# EasyEDA Pro project Driver.epro

# Schematic Schematic1
Create Date: 2023-10-04; Page Name: P1; Project Name: BLDC_V0.1; Schematic Name: Schematic1; Update Date: 2023-10-04; Company: 嘉立创EDA; Page Size: A4; Version: V1.0
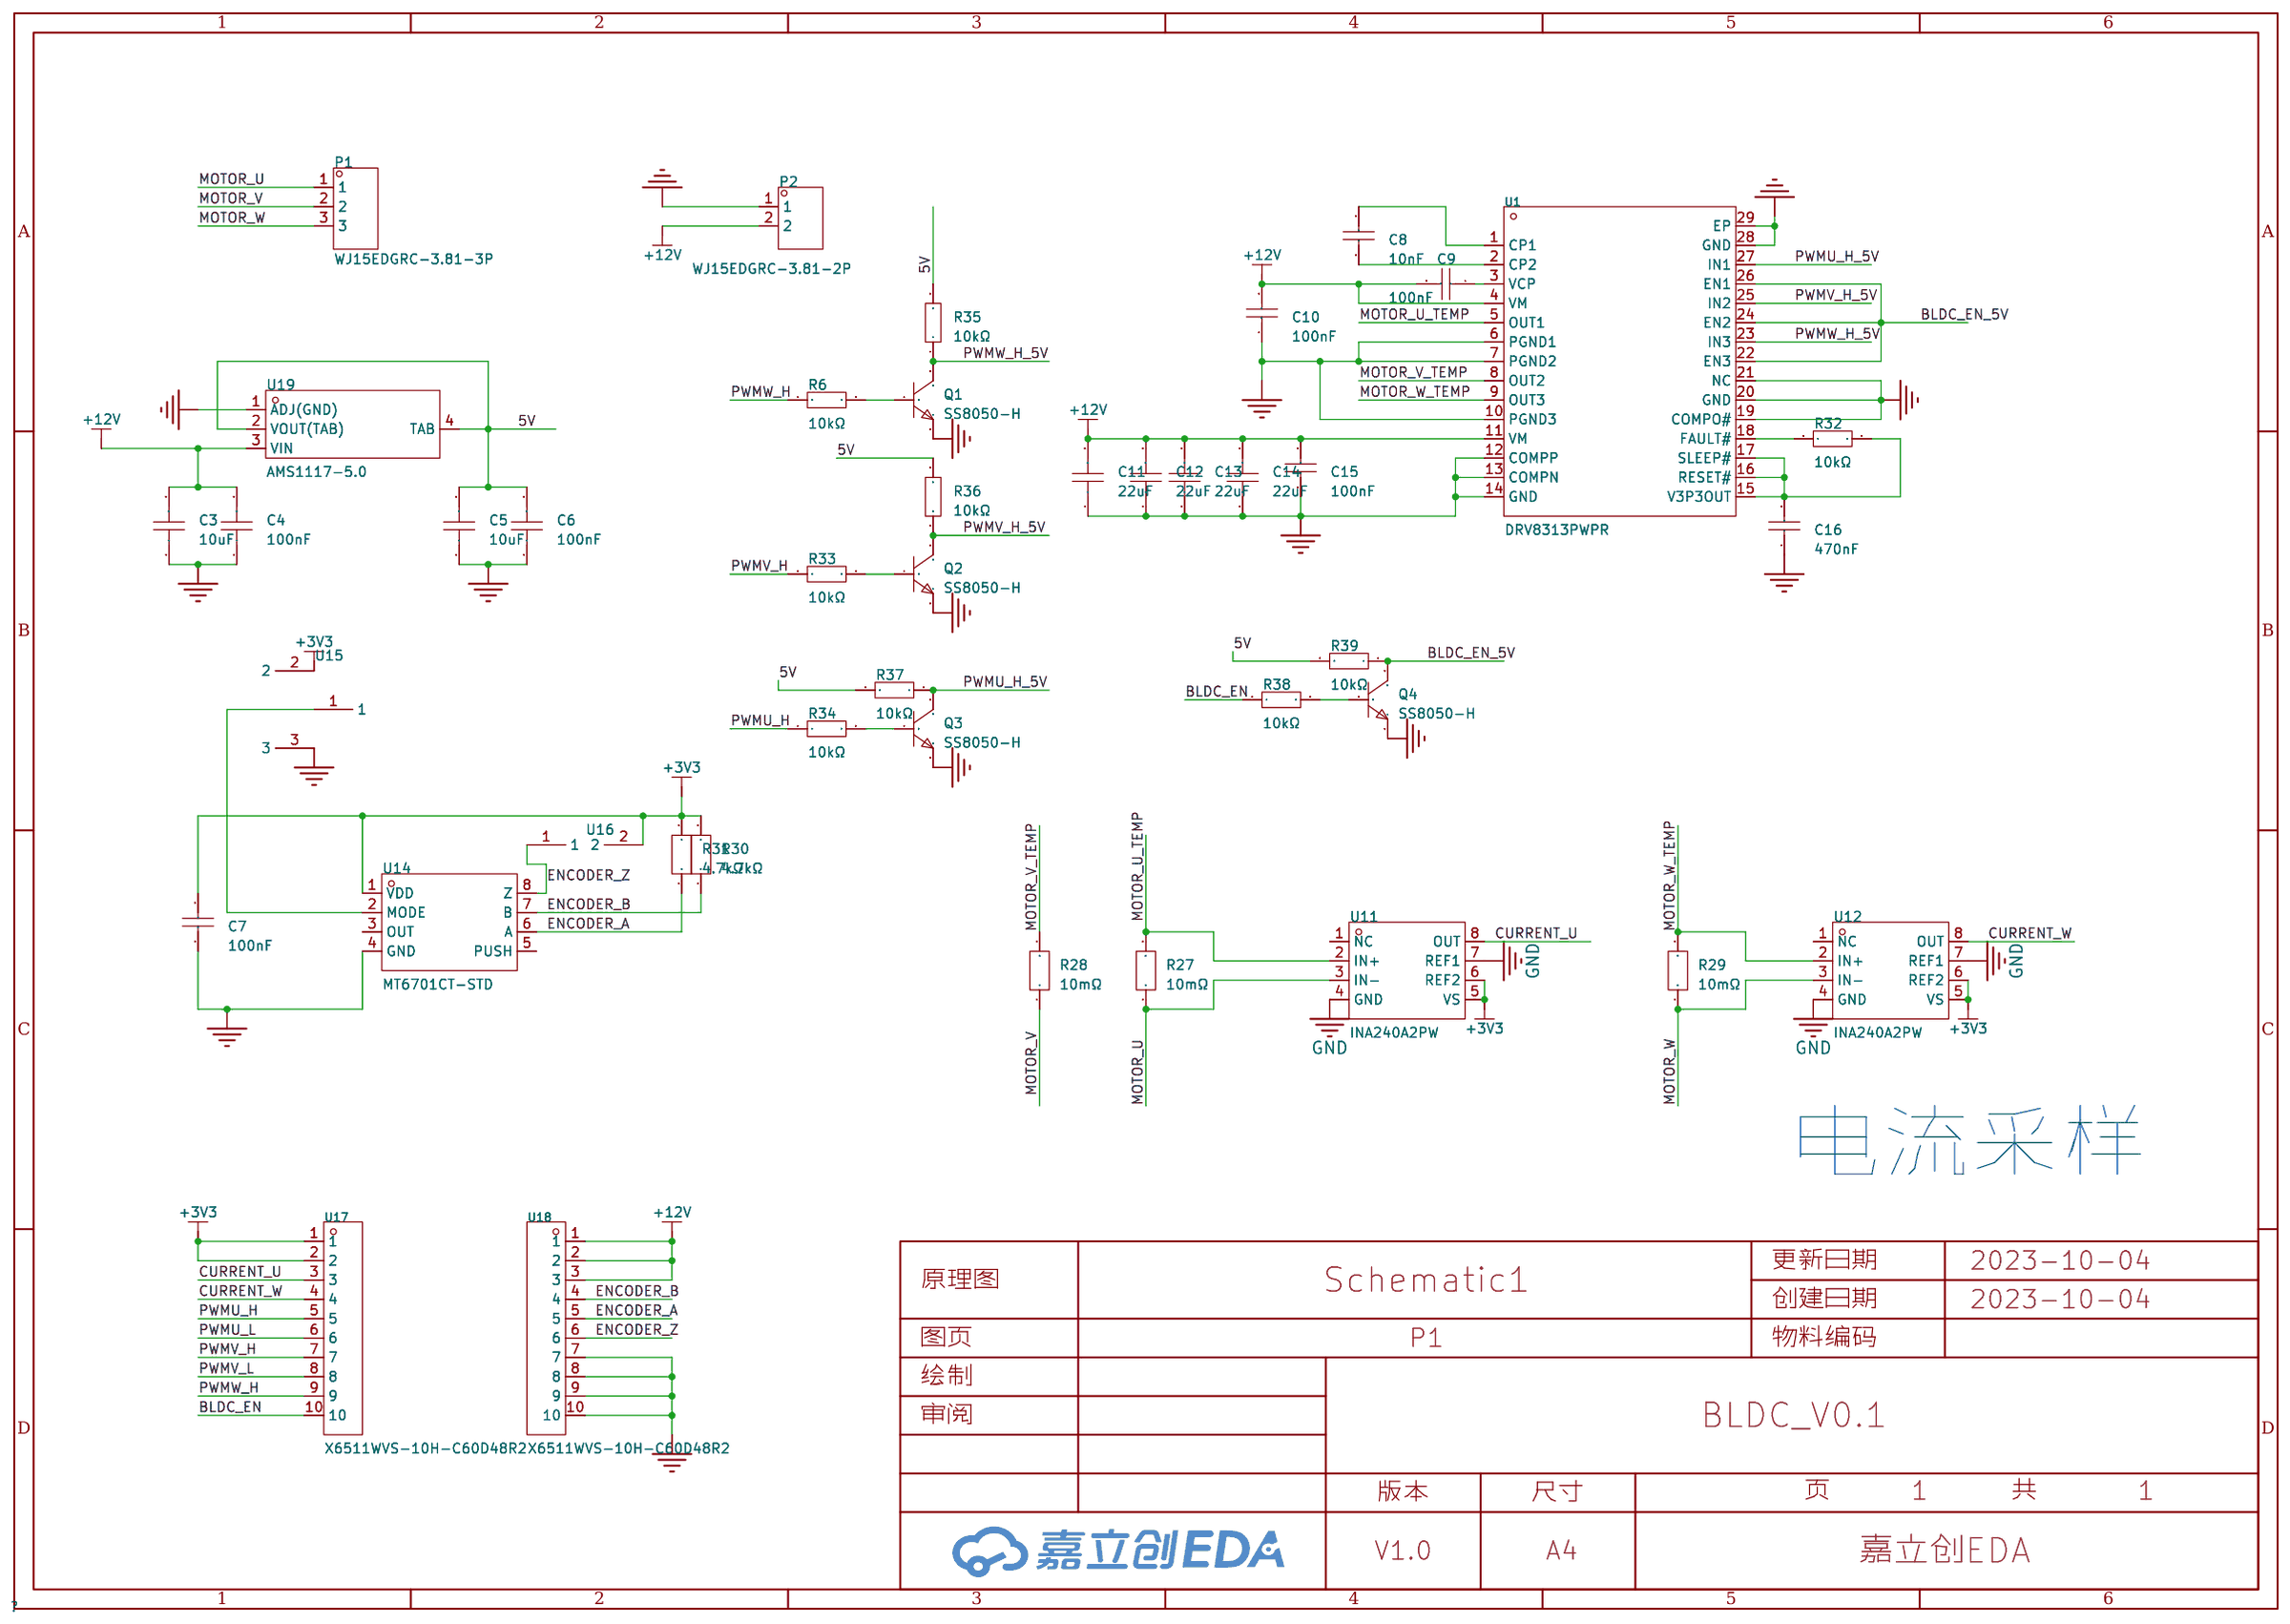
[diagram p0: schematic sheet]

## Parts
C3  10uF  [C0603]
C4  100nF  [C0603]
C5  10uF  [C0603]
C6  100nF  [C0603]
C7  100nF  [C0603]
C8  10nF  [C0603]
C9  100nF  [C0603]
C10  100nF  [C0603]
C11  22uF  [C0805]
C12  22uF  [C0805]
C13  22uF  [C0805]
C14  22uF  [C0805]
C15  100nF  [C0603]
C16  470nF  [C0603]
P1  WJ15EDGRC-3.81-3P  [CONN-TH_3P-P3.81_WJ15EDGRC-3.81-3P]
P2  WJ15EDGRC-3.81-2P  [CONN-TH_2P-P3.81_WJ15EDGRC-3.81-2P]
Q1  SS8050-H  [SOT-23-3_L2.9-W1.3-P1.90-LS2.4-BR]
Q2  SS8050-H  [SOT-23-3_L2.9-W1.3-P1.90-LS2.4-BR]
Q3  SS8050-H  [SOT-23-3_L2.9-W1.3-P1.90-LS2.4-BR]
Q4  SS8050-H  [SOT-23-3_L2.9-W1.3-P1.90-LS2.4-BR]
R6  10kΩ  [R0603]
R27  10mΩ  [RES-SMD_L6.4-W3.2-R2512]
R28  10mΩ  [RES-SMD_L6.4-W3.2-R2512]
R29  10mΩ  [RES-SMD_L6.4-W3.2-R2512]
R30  4.7kΩ  [R0603]
R31  4.7kΩ  [R0603]
R32  10kΩ  [R0603]
R33  10kΩ  [R0603]
R34  10kΩ  [R0603]
R35  10kΩ  [R0603]
R36  10kΩ  [R0603]
R37  10kΩ  [R0603]
R38  10kΩ  [R0603]
R39  10kΩ  [R0603]
U1  DRV8313PWPR  [HTSSOP-28_L9.8-W4.5-P0.65-LS6.6-BL-EP]
U11  INA240A2PW  [TSSOP-8_L4.4-W3.0-P0.65-LS6.4-BR]
U12  INA240A2PW  [TSSOP-8_L4.4-W3.0-P0.65-LS6.4-BR]
U14  MT6701CT-STD  [SOP-8_L4.9-W3.9-P1.27-LS6.0-BL]
U15  -  [三端短接调试]
U16  -  [两端短接调试位]
U17  X6511WVS-10H-C60D48R2  [HDR-SMD_10P-P2.54-V-M-LS4.8_R2]
U18  X6511WVS-10H-C60D48R2  [HDR-SMD_10P-P2.54-V-M-LS4.8_R2]
U19  AMS1117-5.0  [SOT-223_L6.7-W3.5-P2.30-BR]

## Library data of the parts
C3 C5 = CL10A106MA8NRNC: 容值:10uF;精度:±20%;额定电压:25V;材质(温度系数):X5R;; LCSC Part Name: 10uF±20%25V; Supplier Part: C96446; Manufacturer: SAMSUNG(三星); Supplier Footprint: 0603; JLCPCB Part Class: BasicPart; Datasheet: https://atta.szlcsc.com/upload/public/pdf/source/20170325/1490427913016.pdf; Supplier: LCSC; Tolerance: ±20%; Voltage Rated: 25V; Temperature Coefficient: X5R
C4 C6 = CC0603KRX7R9BB104: 容值:100nF;精度:±10%;额定电压:50V;材质(温度系数):X7R;; LCSC Part Name: 100nF±10%50V; Supplier Part: C30926; Manufacturer: YAGEO(国巨); Supplier Footprint: 0603; JLCPCB Part Class: BasicPart; Datasheet: https://atta.szlcsc.com/upload/public/pdf/source/20180910/C282072_33301C7F631E79921B82A8DAC6BCC5B3.pdf; Supplier: LCSC; Tolerance: ±10%; Voltage Rated: 50V; Temperature Coefficient: X7R
C7 C9 C10 C15 = 0603B104K500NT: 容值:100nF;精度:±10%;额定电压:50V;材质(温度系数):X7R;; LCSC Part Name: 100nF±10%50V; Supplier Part: C30926; Manufacturer: FH(风华); Supplier Footprint: 0603; JLCPCB Part Class: ExtendedPart; Datasheet: https://atta.szlcsc.com/upload/public/pdf/source/20170923/C30926_1506149436298988724.pdf; Supplier: LCSC; Tolerance: ±10%; Voltage Rated: 50V; Temperature Coefficient: X7R
C8 = CC0603KRX7R9BB103: 容值:10nF;精度:±10%;额定电压:50V;材质(温度系数):X7R;; LCSC Part Name: 10nF ±10% 50V; Supplier Part: C100042; Manufacturer: YAGEO(国巨); Supplier Footprint: 0603; JLCPCB Part Class: Extended Part; Datasheet: https://atta.szlcsc.com/upload/public/pdf/source/20180326/C100042_E8B0111D51DE3671A0A4A59FBCEFE81C.pdf; Supplier: LCSC; Tolerance: ±10%; Voltage Rated: 50V; Temperature Coefficient: X7R
C11-C14 = CL21A226MAQNNNE_C45783: 容值:22uF;精度:±20%;额定电压:25V;材质(温度系数):X5R;; LCSC Part Name: 22uF ±20% 25V; Supplier Part: C45783; Manufacturer: SAMSUNG(三星); Manufacturer Part: CL21A226MAQNNNE; Supplier Footprint: 0805; JLCPCB Part Class: 基础库; Datasheet: https://atta.szlcsc.com/upload/public/pdf/source/20160103/1457707727161.pdf; Supplier: LCSC; Tolerance: ±20%; Voltage Rated: 25V; Temperature Coefficient: X5R
C16 = CL10B474KA8NNNC: 容值:470nF;精度:±10%;额定电压:25V;材质(温度系数):X7R;; LCSC Part Name: 470nF ±10% 25V; Supplier Part: C1623; Manufacturer: SAMSUNG(三星); Supplier Footprint: 0603; JLCPCB Part Class: Basic Part; Datasheet: https://atta.szlcsc.com/upload/public/pdf/source/20160103/1457707685435.pdf; Supplier: LCSC; Tolerance: ±10%; Voltage Rated: 25V; Temperature Coefficient: X7R
P1 = WJ15EDGRC-3.81-3P: 连接器类型:板端/插座-闭口;结构:1x3P;间距:3.81mm;排数:1;每排PIN数:3;安装方式:弯针;颜色:绿色;; LCSC Part Name: 板端/插座-闭口 1x3P 3.81mm 排数:1 每排P数:3 弯针; Supplier Part: C8406; Manufacturer: KANGNEX(康奈克斯电气); Supplier Footprint: 弯插,P=3.81mm; JLCPCB Part Class: Extended Part; Datasheet: https://atta.szlcsc.com/upload/public/pdf/source/20191225/C8406_B27C5DC97AFF46E3E6AAC690B6FE6CCE.pdf; Supplier: LCSC; Connector Type: 板端/插座-闭口; Structure: 1x3P; Pitch: 3.81mm; Number of Rows: 1; Number of PINs Per Row: 3; Mounting Style: 弯针; Color: 绿色
P2 = WJ15EDGRC-3.81-2P: 连接器类型:板端/插座-闭口;间距:3.81mm;排数:1;每排PIN数:2;安装方式:弯针;颜色:绿色;; LCSC Part Name: 板端/插座-闭口 3.81mm 排数:1 每排P数:2 弯针; Supplier Part: C8387; Manufacturer: KANGNEX(康奈克斯电气); Supplier Footprint: 弯插,P=3.81mm; JLCPCB Part Class: Extended Part; Datasheet: https://atta.szlcsc.com/upload/public/pdf/source/20191225/C8387_8EBAF10345D2762F0167C8753398EEFA.pdf; Supplier: LCSC; Connector Type: 板端/插座-闭口; Pitch: 3.81mm; Number of Rows: 1; Number of PINs Per Row: 2; Mounting Style: 弯针; Color: 绿色
Q1-Q4 = SS8050-H: 晶体管类型:NPN;集射极击穿电压(Vceo):25V;集电极电流(Ic):1.5A;功率(Pd):300mW;直流电流增益(hFE@Ic,Vce):200@100mA,1V;; LCSC Part Name: NPN25V1.5A; Supplier Part: C699255; Manufacturer: YANGJIE(扬杰); Supplier Footprint: SOT-23-3L; JLCPCB Part Class: ExtendedPart; Datasheet: https://atta.szlcsc.com/upload/public/pdf/source/20200709/C699255_98BD284548BE18129453A2CE3A1F2C22.pdf; Supplier: LCSC; Transistor Type: NPN; Collector-Emitter Breakdown Voltage (Vceo): 25V; Collector Current (Ic): 1.5A; Power Dissipation (Pd): 300mW; Collector Cut-Off Current (Icbo): 100nA; Collector-Emitter Saturation Voltage (VCE(sat)@Ic,Ib): 500mV@800mA,80mA; DC Current Gain (hFE@Ic,Vce): 200@100mA,1V; Transition Frequency (fT): 100MHz; Operating Temperature: -55℃~+150℃@(Tj)
R6 R33-R39 = ERJ3EKF1002V: 电阻类型:厚膜电阻;阻值:10kΩ;精度:±1%;功率:100mW;; LCSC Part Name: 厚膜电阻10kΩ±1%100mW; Supplier Part: C25804; Manufacturer: PANASONIC(松下); Supplier Footprint: 0603; JLCPCB Part Class: ExtendedPart; Datasheet: https://atta.szlcsc.com/upload/public/pdf/source/20180502/C191124_A4CEFA964CCDF04BFD540D495CFFCAE0.pdf; Supplier: LCSC; Type: 厚膜电阻; Tolerance: ±1%; Power(Watts): 100mW; Temperature Coefficient: ±100ppm/℃; Operating Temperature Range: -55℃~+155℃
R27-R29 = HoJLR2512-3W-10mR-1%: 阻值:10mΩ;功率:3W;; LCSC Part Name: 10mΩ 3W; Supplier Part: C2903468; Manufacturer: Milliohm(毫欧); Supplier Footprint: 2512; JLCPCB Part Class: Extended Part; Datasheet: https://atta.szlcsc.com/upload/public/pdf/source/20211009/7525CABAB363C979E942C1DD41F1FEF0.pdf; Supplier: LCSC; Power(Watts): 3W
R30 R31 = HoLTT0603-1/10W-4.7K-1%: 阻值:4.7kΩ;功率:100mW;; LCSC Part Name: 4.7kΩ 100mW; Supplier Part: C2904521; Manufacturer: Milliohm(毫欧); Supplier Footprint: 0603; JLCPCB Part Class: Extended Part; Datasheet: https://atta.szlcsc.com/upload/public/pdf/source/20211021/528351F376078D6228C985A842C3763C.pdf; Supplier: LCSC; Power(Watts): 100mW
R32 = 0603WAF1002T5E: 电阻类型:厚膜电阻;阻值:10kΩ;精度:±1%;功率:100mW;; LCSC Part Name: 厚膜电阻 10kΩ ±1% 100mW; Supplier Part: C25804; Manufacturer: UNI-ROYAL(厚声); Supplier Footprint: 0603; JLCPCB Part Class: 基础库; Datasheet: https://atta.szlcsc.com/upload/public/pdf/source/20200306/C422600_1E6D84923E4A46A82E41ADD87F860B5C.pdf; Supplier: LCSC; Type: 厚膜电阻; Tolerance: ±1%; Power(Watts): 100mW; Temperature Coefficient: ±100ppm/℃; Overload Voltage (Max): 75V; Operating Temperature Range: -55℃~+155℃
U1 = DRV8313PWPR: 类型:无刷直流BLDC;电源电压:8V~60V;输出电流:-;接口:并行;; LCSC Part Name: 无刷直流BLDC电机驱动芯片 60V; Supplier Part: C92482; Manufacturer: TI(德州仪器); Supplier Footprint: TSSOP-28-EP; JLCPCB Part Class: 扩展库; Datasheet: https://www.ti.com/cn/lit/gpn/drv8313; Supplier: LCSC; Type: 无刷直流BLDC; Supply Voltage: 8V~60V; Interface: 并行; Operating Temperature: -40℃~+150℃@(Tj)
U11 U12 = INA240A2PW: 具有增强的 PWM 抑制能力的 -4V 至 80V、双向、超精密电流感应放大器 8-TSSOP -40 to 125; Supplier Part: C1346461; Manufacturer: TI(德州仪器); Supplier Footprint: TSSOP-8-3.0mm; JLCPCB Part Class: Extended Part; Datasheet: https://atta.szlcsc.com/upload/public/pdf/source/20210607/AED5CCB0280C8C5A414BD6EEEB43F6C3.pdf; Supplier: LCSC
U14 = MT6701CT-STD: 磁性编码器 磁性编码开关 磁性角度检测IC 可编程磁性角度位置芯片; LCSC Part Name: 霍尔在线编程角度位置传感器; Supplier Part: C2856764; Manufacturer: MagnTek(麦歌恩); Supplier Footprint: SOP-8; JLCPCB Part Class: 扩展库; Datasheet: https://atta.szlcsc.com/upload/public/pdf/source/20210901/89396AA55DF26524CEF7734A3D9C2FB3.pdf; Supplier: LCSC
U15 = 三段短接调试
U16 = 两端短接调试位
U17 U18 = X6511WVS-10H-C60D48R2: 间距:2.54mm;总PIN位数:10;排数:1;插针结构:1x10P;行距:-;安装类型:立贴;圆针/方针:方针;额定电流:3A;额定电压:250V;配合针长度:6mm;塑高:2.5mm;触头材质:黄铜;触头镀层:金;工作温度范围:-40℃~+105℃;焊接温度(最大值):260℃;; LCSC Part Name: 2.54mm 1x10P; Supplier Part: C2883767; Manufacturer: XKB Connectivity(中国星坤); Supplier Footprint: SMD,P=2.54mm(交错脚); JLCPCB Part Class: 扩展库; Supplier: LCSC; Pitch: 2.54mm; Number of Pins: 10; Number of Rows: 1; Pin Structure: 1x10P; Mounting Type: 立贴; Circluar Pins/Square Pins: 方针; Current Rating (Max): 3A; Voltage Rating (Max): 250V; Length of Mating Pin: 6mm; Insulation Height: 2.5mm; Contact Material: 黄铜; Contact Plating: 金; Operating Temperature Range: -40℃~+105℃; Welding Temperature (Max): 260℃
U19 = AMS1117-5.0_C347223: 输出类型:固定;输出极性:正;最大输入电压:18V;输出电压:5V;输出电流:1A;电源纹波抑制比(PSRR):60dB@(120Hz);; LCSC Part Name: 输入18V 输出5V 1A; Supplier Part: C347223; Manufacturer: UMW(广东友台半导体); Supplier Footprint: SOT-223; JLCPCB Part Class: Extended Part; Datasheet: https://atta.szlcsc.com/upload/public/pdf/source/20211011/50CC665C22E3A66C08379A4A74BDA25C.pdf; Supplier: LCSC; Output Type: 固定; Output Polarity: 正; Number of Outputs: 1; Maximum Input Voltage: 18V; Output Voltage: 5V; Dropout Voltage: 1.3V@(1A); Output Current: 1A; Power Supply Rejection Ratio (PSRR): 60dB@(120Hz)

## Nets
5V: C5.2 C6.2 R35.2 R36.2 R37.2 R39.2 U19.2(VOUT(TAB)) U19.4(TAB)
+3V3: C7.2 R30.2 R31.2 U11.5(VS) U11.6(REF2) U12.5(VS) U12.6(REF2) U14.1(VDD) U15.2 U16.2 U17.1 U17.2
+12V: C3.2 C4.2 C9.2 C10.2 C11.2 C12.2 C13.2 C14.2 C15.1 P2.2 U1.4(VM) U1.11(VM) U18.1 U18.2 U18.3 U19.3(VIN)
GND: C3.1 C4.1 C5.1 C6.1 C7.1 C10.1 C11.1 C12.1 C13.1 C14.1 C15.2 C16.1 P2.1 Q1.2(E) Q2.2(E) Q3.2(E) Q4.2(E) U1.6(PGND1) U1.7(PGND2) U1.10(PGND3) U1.12(COMPP) U1.13(COMPN) U1.14(GND) U1.19(COMPO#) U1.20(GND) U1.21(NC) U1.28(GND) U1.29(EP) U11.4(GND) U11.7(REF1) U12.4(GND) U12.7(REF1) U14.4(GND) U15.3 U18.7 U18.8 U18.9 U18.10 U19.1(ADJ(GND))
BLDC_EN: R38.1 U17.10
BLDC_EN_5V: Q4.3(C) R39.1 U1.22(EN3) U1.24(EN2) U1.26(EN1)
CURRENT_U: U11.8(OUT) U17.3
CURRENT_W: U12.8(OUT) U17.4
ENCODER_A: R31.1 U14.6(A) U18.5
ENCODER_B: R30.1 U14.7(B) U18.4
ENCODER_Z: U14.8(Z) U16.1 U18.6
MOTOR_U: P1.1 R27.1 U11.3(IN-)
MOTOR_U_TEMP: R27.2 U1.5(OUT1) U11.2(IN+)
MOTOR_V: P1.2 R28.1
MOTOR_V_TEMP: R28.2 U1.8(OUT2)
MOTOR_W: P1.3 R29.1 U12.3(IN-)
MOTOR_W_TEMP: R29.2 U1.9(OUT3) U12.2(IN+)
PWMU_H: R34.1 U17.5
PWMU_H_5V: Q3.3(C) R37.1 U1.27(IN1)
PWMU_L: U17.6
PWMV_H: R33.1 U17.7
PWMV_H_5V: Q2.3(C) R36.1 U1.25(IN2)
PWMV_L: U17.8
PWMW_H: R6.1 U17.9
PWMW_H_5V: Q1.3(C) R35.1 U1.23(IN3)
$1N503: U14.2(MODE) U15.1
$1N1583: C8.1 U1.2(CP2)
$1N1586: C8.2 U1.1(CP1)
$1N1604: C9.1 U1.3(VCP)
$1N1822: R32.2 U1.18(FAULT#)
$1N1825: C16.2 R32.1 U1.15(V3P3OUT) U1.16(RESET#) U1.17(SLEEP#)
$1N2334: Q1.1(B) R6.2
$1N2420: Q2.1(B) R33.2
$1N2505: Q3.1(B) R34.2
$1N2864: Q4.1(B) R38.2

Not connected (* = marked no-connect by the designer): U11 1(NC); U12 1(NC); U14 3(OUT) 5(PUSH)

## Notes on the sheet
- 电流采样

# Board PCB1
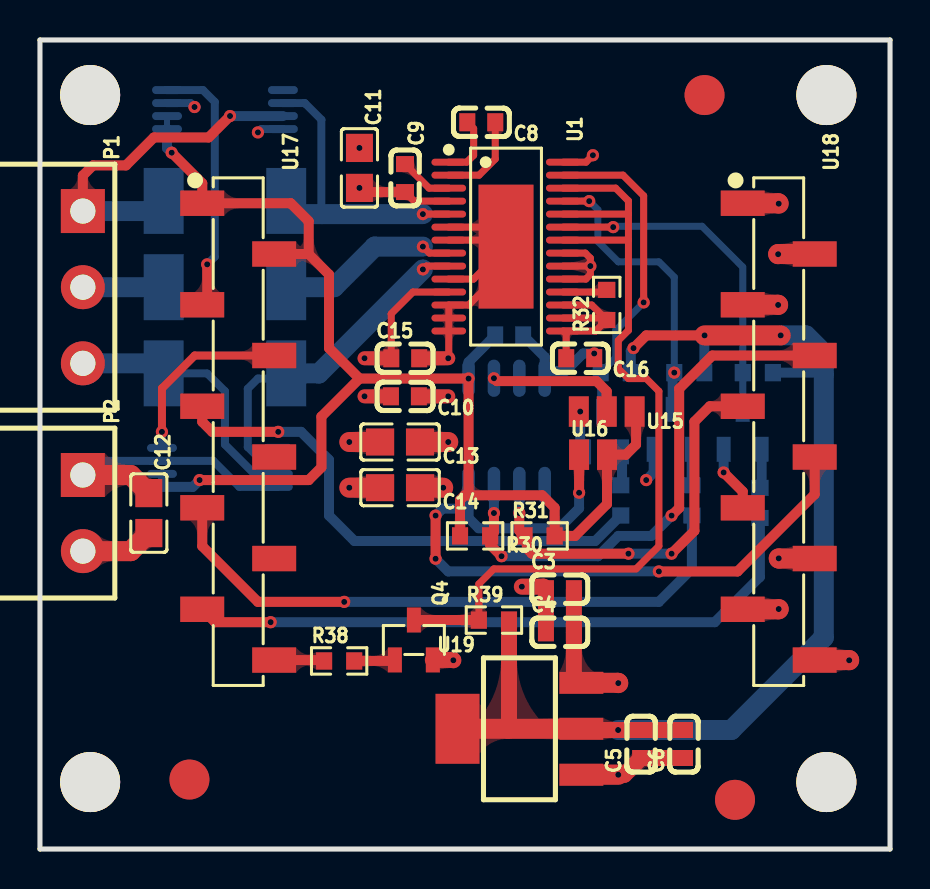
[diagram p1: board, top side]
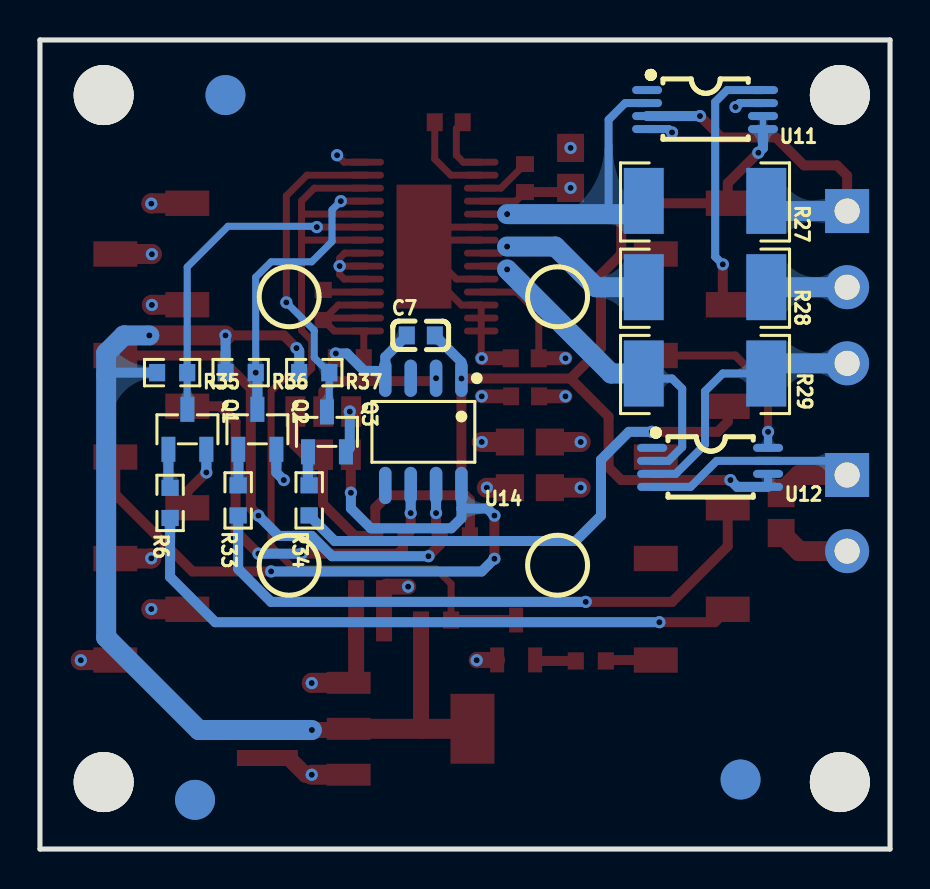
[diagram p2: board, bottom side, seen from below]

Outline 42.54 x 40.49 mm; copper layers: Top Layer, POWER, GND, Bottom Layer. Coordinates in mm from the lower left corner of the outline.
Outline path: 0,40.49 42.54,40.49 42.54,0 0,0 0,40.49
Stack: Top Layer 0.035mm 外层铜厚1oz / Dielectric1 0.2104mm 7628 RC49% 8.6mil / POWER 0.0152mm 内层铜厚 / Dielectric2 1.065mm 1.1mm H/HOZ 含铜 / GND 0.0152mm 内层铜厚 / Dielectric3 0.2104mm 7628 RC49% 8.6mil / Bottom Layer 0.035mm 外层铜厚1oz

## Design rules (mm)
template: 自定义配置
spacing copperThickness1oz (default): track to track 0.102, other pairs 0.152 to 0.3
spacing copperThickness2oz: track to track 0.203, other pairs 0.152 to 0.3
track width copperThickness1oz (default): min 0.127, default 0.254, max 5
track width copperThickness2oz: min 0.203, default 0.254, max 2.54
differential pair differentialPair (default): width min 0.127, default 0.254, max 2.54; gap min 0.152, default 0.152
via viaSize (default): diameter min 0.5, default 0.61, max 10; hole min 0.3, default 0.305, max 6.3

## Placement (name value [footprint] x y rotation side)
C3  10uF  [C0603]  26.02 13 0 top
C4  100nF  [C0603]  26.02 10.84 0 top
C5  10uF  [C0603]  30.09 5.26 90 top
C6  100nF  [C0603]  32.24 5.26 90 top
C7  100nF  [C0603]  23.48 25.7 180 bottom
C8  10nF  [C0603]  22.09 36.37 180 top
C9  100nF  [C0603]  18.27 33.58 270 top
C10  100nF  [C0603]  18.27 22.65 180 top
C11  22uF  [C0805]  15.99 34.08 270 top
C12  22uF  [C0805]  5.45 16.81 270 top
C13  22uF  [C0805]  18.02 20.37 180 top
C14  22uF  [C0805]  18.02 18.08 180 top
C15  100nF  [C0603]  18.28 24.56 0 top
C16  470nF  [C0603]  27.04 24.56 180 top
NOREF  -  [Pad_e3398]  7.48 3.48 0 top
NOREF#2  -  [Pad_e1113]  39.36 37.73 0 top
NOREF#3  -  [Pad_e3401]  34.79 2.46 0 top
NOREF#4  -  [Pad_e3400]  7.48 3.48 0 top
NOREF#5  -  [Pad_e1137]  2.51 37.73 0 top
NOREF#6  -  [Pad_e1139]  2.51 3.35 0 top
NOREF#7  -  [Pad_e1116]  39.36 3.35 0 top
NOREF#8  -  [Pad_e3402]  33.26 37.73 0 top
NOREF#9  -  [Pad_e3397]  34.79 2.46 0 top
NOREF#10  -  [Pad_e3395]  33.26 37.73 0 top
P1  WJ15EDGRC-3.81-3P  [CONN-TH_3P-P3.81_WJ15EDGRC-3.81-3P]  2.15 28.12 270 top
P2  WJ15EDGRC-3.81-2P  [CONN-TH_2P-P3.81_WJ15EDGRC-3.81-2P]  2.15 16.81 270 top
Q1  SS8050-H  [SOT-23-3_L2.9-W1.3-P1.90-LS2.4-BR]  35.17 21 270 bottom
Q2  SS8050-H  [SOT-23-3_L2.9-W1.3-P1.90-LS2.4-BR]  31.66 21 270 bottom
Q3  SS8050-H  [SOT-23-3_L2.9-W1.3-P1.90-LS2.4-BR]  28.18 20.88 270 bottom
Q4  SS8050-H  [SOT-23-3_L2.9-W1.3-P1.90-LS2.4-BR]  18.71 10.46 270 top
R6  10kΩ  [R0603]  36.03 17.32 90 bottom
R27  10mΩ  [RES-SMD_L6.4-W3.2-R2512]  9.26 32.43 0 bottom
R28  10mΩ  [RES-SMD_L6.4-W3.2-R2512]  9.26 28.12 0 bottom
R29  10mΩ  [RES-SMD_L6.4-W3.2-R2512]  9.26 23.8 0 bottom
R30  4.7kΩ  [R0603]  21.78 15.67 180 top
R31  4.7kΩ  [R0603]  25.01 15.67 0 top
R32  10kΩ  [R0603]  28.37 27.23 90 top
R33  10kΩ  [R0603]  32.63 17.45 90 bottom
R34  10kΩ  [R0603]  29.07 17.45 90 bottom
R35  10kΩ  [R0603]  35.93 23.84 0 bottom
R36  10kΩ  [R0603]  32.5 23.84 0 bottom
R37  10kΩ  [R0603]  28.82 23.84 0 bottom
R38  10kΩ  [R0603]  14.97 9.41 0 top
R39  10kΩ  [R0603]  22.72 11.46 0 top
U1  DRV8313PWPR  [HTSSOP-28_L9.8-W4.5-P0.65-LS6.6-BL-EP]  23.33 30.15 270 top
U11  INA240A2PW  [TSSOP-8_L4.4-W3.0-P0.65-LS6.4-BR]  9.26 37.01 0 bottom
U12  INA240A2PW  [TSSOP-8_L4.4-W3.0-P0.65-LS6.4-BR]  9 19.1 0 bottom
U14  MT6701CT-STD  [SOP-8_L4.9-W3.9-P1.27-LS6.0-BL]  23.36 20.88 0 bottom
U15  -  [三端短接调试]  28.37 21.89 180 top
U16  -  [两端短接调试位]  26.98 19.73 0 top
U17  X6511WVS-10H-C60D48R2  [HDR-SMD_10P-P2.54-V-M-LS4.8_R2]  9.92 20.89 270 top
U18  X6511WVS-10H-C60D48R2  [HDR-SMD_10P-P2.54-V-M-LS4.8_R2]  36.97 20.89 270 top
U19  AMS1117-5.0  [SOT-223_L6.7-W3.5-P2.30-BR]  24 6.02 0 top

## Footprints (pads in the part's own frame, mm; a bottom-side part is the same pattern mirrored in y, then rotated)
C0603
  rect 0.8x0.9 smd: 1(-0.7,0) 2(0.7,0)
C0805
  rect 1.41x1.35 smd: 1(-1,0) 2(1,0)
CONN-TH_2P-P3.81_WJ15EDGRC-3.81-2P
  rect 2.2x2.2 hole 1.26: 1(-1.905,0)
  round 2.2 hole 1.26: 2(1.905,0)
CONN-TH_3P-P3.81_WJ15EDGRC-3.81-3P
  rect 2.2x2.2 hole 1.26: 1(-3.81,0)
  round 2.2 hole 1.26: 2(0,0) 3(3.81,0)
HDR-SMD_10P-P2.54-V-M-LS4.8_R2
  rect 1.27x2.2 smd: 1(-11.43,-1.8) 2(-8.89,1.8) 3(-6.35,-1.8) 4(-3.81,1.8) 5(-1.27,-1.8) 6(1.27,1.8) 7(3.81,-1.8) 8(6.35,1.8) 9(8.89,-1.8) 10(11.43,1.8)
HTSSOP-28_L9.8-W4.5-P0.65-LS6.6-BL-EP
  oval 0.343x1.732 smd: 1(-4.225,-2.866) 2(-3.575,-2.866) 3(-2.925,-2.866) 4(-2.275,-2.866) 5(-1.625,-2.866) 6(-0.975,-2.866) 7(-0.325,-2.866) 8(0.325,-2.866) 9(0.975,-2.866) 10(1.625,-2.866) 11(2.275,-2.866) 12(2.925,-2.866) 13(3.575,-2.866) 14(4.225,-2.866) 15(4.225,2.866) 16(3.575,2.866) 17(2.925,2.866) 18(2.275,2.866) 19(1.625,2.866) 20(0.975,2.866) 21(0.325,2.866) 22(-0.325,2.866) 23(-0.975,2.866) 24(-1.625,2.866) 25(-2.275,2.866) 26(-2.925,2.866) 27(-3.575,2.866) 28(-4.225,2.866)
  rect 6.2x2.75 smd: 29(0,0)
Pad_e1113
  round 3 hole 3: 30(0,0)
Pad_e1116
  round 3 hole 3: 30(0,0)
Pad_e1137
  round 3 hole 3: 30(0,0)
Pad_e1139
  round 3 hole 3: 30(0,0)
Pad_e3395
  round 2 smd: 1(0,0)
Pad_e3397
  round 2 smd: 1(0,0)
Pad_e3398
  round 2 smd: 1(0,0)
Pad_e3400
  round 2 smd far side: 1(0,0)
Pad_e3401
  round 2 smd far side: 1(0,0)
Pad_e3402
  round 2 smd far side: 1(0,0)
R0603
  rect 0.806x0.864 smd: 1(-0.753,0) 2(0.753,0)
RES-SMD_L6.4-W3.2-R2512
  rect 2x3.3 smd: 1(-3.067,0) 2(3.067,0)
SOP-8_L4.9-W3.9-P1.27-LS6.0-BL
  oval 0.63x1.865 smd: 1(-1.905,-2.683) 2(-0.635,-2.683) 3(0.635,-2.683) 4(1.905,-2.683) 5(1.905,2.683) 6(0.635,2.683) 7(-0.635,2.683) 8(-1.905,2.683)
SOT-23-3_L2.9-W1.3-P1.90-LS2.4-BR
  rect 1.25x0.7 smd: 1(1,-0.95) 2(1,0.95) 3(-1,0)
SOT-223_L6.7-W3.5-P2.30-BR
  rect 2.2x1.1 smd: 1(3.099,-2.3) 2(3.099,0) 3(3.099,2.3)
  rect 2.2x3.5 smd: 4(-3.099,0)
TSSOP-8_L4.4-W3.0-P0.65-LS6.4-BR
  oval 1.5x0.4 smd: 1(2.9,-0.976) 2(2.9,-0.325) 3(2.9,0.325) 4(2.9,0.976) 5(-2.9,0.976) 6(-2.9,0.325) 7(-2.9,-0.325) 8(-2.9,-0.976)
三端短接调试
  rect 1x1.524 smd: 1(0,0) 2(-1.397,0) 3(1.397,0)
两端短接调试位
  rect 1x1.524 smd: 1(0,0) 2(1.397,0)

## Nets
As in the schematic.

Pads without a net: NOREF 1; NOREF#2 30; NOREF#3 1; NOREF#4 1; NOREF#5 30; NOREF#6 30; NOREF#7 30; NOREF#8 1; NOREF#9 1; NOREF#10 1; U11 1; U12 1; U14 3 5

## Via types
v1: diameter 0.61, hole 0.305, Top Layer to Bottom Layer, 59 vias

## Routing (per net, layer and track width the routed paths; a pad name or vN(x,y) marks a point on that pad's centre or on a via; arc(x,y) is an arc through that point)
5V: length 59.1
  Top Layer w0.5: v1(29.71,25.07) 30.34,25.7 v1(33.26,25.7)
  Top Layer w0.8: R39.2 23.47,6.06 23.43,6.02 ; U19.2 27.16,5.96 v1(28.94,5.96) C5.2 C6.2
  Top Layer w1: U19.2 U19.4 ; v1(37.07,25.7) v1(33.26,25.7)
  Bottom Layer w0.5: R35.2 39.14,23.84 39.23,23.75 ; v1(33.26,25.7) 33.25,25.69 R36.2 ; v1(29.71,25.07) 29.57,24.93 R37.2
  Bottom Layer w1: v1(37.07,25.7) 38.34,25.7 39.23,24.81 39.23,10.59 34.6,5.96 v1(28.94,5.96)
+3V3: length 67.1
  Top Layer w0.5: v1(7.99,18.46) 13.45,18.46 14.09,19.1 14.09,21.64 15.99,23.54 ; 15.99,23.54 14.47,25.07 14.47,28.75 13.44,29.78 ; 15.99,23.54 v1(21.45,23.54) 21.45,17.7 ; 21.45,17.7 21.26,17.7 21.02,17.47 R30.2 ; 21.45,17.7 25.13,17.7 25.76,17.07 R31.2 26.78,15.67 28.38,17.26 U16.2 29.32,19.73 29.83,20.24 29.83,21.82 U15.2 ; 13.44,29.78 13.45,29.79 13.45,31.42 12.55,32.32 U17.1 8.12,33.32 v1(6.59,34.85) ; 13.44,29.78 U17.2
  Bottom Layer w0.3: U11.6 U11.5
  Bottom Layer w0.4: U12.5 U12.6
  Bottom Layer w0.5: v1(7.99,18.46) 7.65,18.12 U12.5 ; C7.2 21.45,24.37 U14.1 ; v1(6.59,34.85) 6.36,35.08 U11.5
+12V: length 31.8
  Top Layer w0.35: 17.58,24.56 17.58,26.79 18.67,27.87 U1.11 ; U1.4 18.72,32.42 C9.2
  Top Layer w0.5: v1(15.99,33.08) 16.2,32.88 C9.2
  Top Layer w0.7: 17.58,24.56 v1(16.24,24.56) ; C10.2 v1(16.24,22.65)
  Top Layer w0.8: C3.2 C4.2 26.72,8.69 U19.3
  Top Layer w1: U18.3 36.94,27.24 v1(36.94,27.23) ; U18.2 36.95,29.78 v1(36.94,29.77) ; C12.2 4.54,14.91 P2.2 ; v1(28.94,8.3) 28.93,8.32 U19.3 ; C13.2 v1(15.48,20.37) ; U18.1 36.95,32.32 v1(36.97,32.29) ; C14.2 v1(15.48,18.08)
GND: length 67.5
  Top Layer w0.35: U1.10 21.7,28.52 22.38,29.2 ; U1.20 v1(27.55,29.17) ; v1(27.55,29.17) 27.55,28.75 27.32,28.52 U1.19 ; v1(27.55,29.17) 27.55,29.57 27.29,29.82 U1.21 ; U1.7 22.22,30.47 ; U1.28 27.33,34.37 v1(27.67,34.72) ; 22.38,31.09 22.35,31.12 U1.6 ; 22.41,28.18 21.45,27.22 U1.12 U1.13 U1.14 20.46,24.58 v1(20.44,24.56)
  Top Layer w0.5: U18.7 35.17,17.89 v1(34.22,18.84)
  Top Layer w0.7: C15.2 v1(20.44,24.56) ; C10.1 v1(20.44,22.65)
  Top Layer w0.8: v1(28.94,3.72) 29.25,3.72 C5.1 C6.1 ; v1(20.69,9.45) 20.67,9.46 Q4.2 ; v1(24.12,13.13) 25.2,13.13 C3.1 25.32,11.35
  Top Layer w1: C13.1 v1(20.44,20.37) ; 27.1,3.72 v1(28.94,3.72) ; U18.10 40.49,9.46 v1(40.5,9.45) ; 2.15,18.72 4.54,18.72 C12.1 ; v1(36.97,12.01) 36.96,12 U18.9 ; v1(36.97,14.55) 36.98,14.54 U18.8 ; v1(20.18,18.08) C14.1
  Bottom Layer w0.4: v1(7.73,37.13) 7.54,37.33 U11.7 ; v1(10.91,35.86) 11.08,36.03 U11.4 ; U12.4 9.98,18.12 8.68,19.42 U12.7 2.85,19.42 2.15,18.72
  Bottom Layer w0.5: Q3.2 27.04,20.07 v1(27.04,21.89) ; v1(30.34,18.46) 30.71,18.84 Q2.2 ; 25.26,23.92 26.31,23.92 27.18,24.8 v1(27.74,24.8) ; 25.26,23.92 25.26,24.62 C7.1 ; 25.26,23.92 U14.4 ; 34.22,20 v1(34.22,18.84)
  vias: v1(15.99,35.08)
BLDC_EN: length 2.5
  Top Layer w0.5: R38.1 14.18,9.46 U17.10
BLDC_EN_5V: length 43.7
  Top Layer w0.35: U1.22 29.45,30.47 ; 29.45,30.47 29.45,25.96 28.94,25.45 28.94,24.05 29.45,23.54 30.34,23.54 30.98,22.91 30.98,15.16 29.83,14.02 22.72,14.02 21.97,13.26 R39.1 ; 29.45,30.47 29.45,31.77 ; U1.24 29.45,31.77 ; 29.45,31.77 29.45,32.43 28.81,33.07 U1.26
  Top Layer w0.5: R39.1 21.96,11.46 Q4.3
CURRENT_U: length 13
  Top Layer w0.5: U17.3 8.37,27.48 v1(8.37,29.26)
  Bottom Layer w0.4: U11.8 8.16,37.98 8.75,37.39 8.75,29.64 v1(8.37,29.26)
CURRENT_W: length 9.3
  Top Layer w0.4: v1(6.1,20.88) 6.1,23.06 7.75,24.7 U17.4
  Bottom Layer w0.4: U12.8 v1(6.1,20.88)
ENCODER_A: length 20.5
  Top Layer w0.5: v1(31.61,14.78) 32.75,15.92 32.75,21.38 33.53,22.16 U18.5 ; v1(29.45,14.78) 24.63,14.78 24.37,15.03 24.37,15.55 R31.1 23.99,15.93 v1(23.99,16.81)
  Bottom Layer w0.5: U14.6 v1(23.99,16.81) ; v1(29.45,14.78) v1(31.61,14.78)
ENCODER_B: length 27.2
  Top Layer w0.5: v1(23.1,14.65) 22.53,15.22 22.53,15.67 22.72,15.86 v1(22.72,16.81) ; U18.4 33.65,24.7 31.99,23.04 31.99,17.07 v1(31.61,16.69)
  Bottom Layer w0.5: U14.7 v1(22.72,16.81) ; v1(23.1,14.65) 27.93,14.65 28.94,15.67 30.59,15.67 v1(31.61,16.69)
ENCODER_Z: length 37.1
  Top Layer w0.5: U18.6 38.77,17.75 34.91,13.89 v1(30.98,13.89) ; U16.1 v1(26.98,17.83) ; v1(19.8,16.69) v1(19.8,14.53)
  Bottom Layer w0.5: 21.45,17.04 21.45,16.56 21.96,16.05 25.98,16.05 26.98,17.05 v1(26.98,17.83) ; 21.45,17.04 U14.8 ; 21.45,17.04 20.15,17.04 v1(19.8,16.69) ; v1(19.8,14.53) 20.44,13.89 v1(30.98,13.89)
MOTOR_U: length 17.3
  Top Layer w0.5: P1.1 2.15,33.7 2.66,34.21 4.31,34.21 5.7,35.61 8.44,35.61 v1(9.51,36.68)
  Bottom Layer w0.5: U11.3 v1(9.51,36.68)
  Bottom Layer w1: P1.1 5.68,31.93 R27.1
MOTOR_U_TEMP: length 15.4
  Top Layer w0.35: U1.5 v1(19.16,31.77)
  Bottom Layer w0.4: 14.11,31.77 14.09,31.8 14.09,36.5 13.25,37.33 U11.2
  Bottom Layer w1: v1(19.16,31.77) 12.99,31.77 R27.2
MOTOR_V: length 4
  Bottom Layer w1: P1.2 R28.1
MOTOR_V_TEMP: length 9.1
  Top Layer w0.35: v1(19.16,30.15) 19.49,29.82 U1.8
  Bottom Layer w1: R28.2 14.72,28.12 16.75,30.15 v1(19.16,30.15)
MOTOR_W: length 13.6
  Bottom Layer w0.4: R29.1 8.37,23.8 9.26,22.91 9.26,20.24 10.73,18.77 U12.3
  Bottom Layer w1: P1.3 5.68,24.31 R29.1
MOTOR_W_TEMP: length 17.3
  Top Layer w0.35: U1.9 19.33,29.17 v1(19.16,29)
  Bottom Layer w0.4: U12.2 11.09,19.42 10.4,20.11 10.4,23.04 10.91,23.54 12.07,23.54 R29.2
  Bottom Layer w1: v1(19.16,29) 13.96,23.8 R29.2
PWMU_H: length 26.4
  Top Layer w0.5: v1(11.93,20.88) 8.62,20.88 8.12,21.38 U17.5
  Bottom Layer w0.5: v1(11.93,20.88) 13.07,20.88 14.47,19.48 14.47,16.69 15.74,15.42 27.79,15.42 R34.1
PWMU_H_5V: length 16.2
  Top Layer w0.35: U1.27 29.18,33.72 30.21,32.69 v1(30.21,27.35)
  Bottom Layer w0.35: Q3.3 28.06,21.99 R37.1 28.82,24.59 28.82,25.96 v1(30.21,27.35)
PWMV_H: length 30.9
  Top Layer w0.5: U17.7 8.12,15.16 10.91,12.37 v1(15.23,12.37)
  Bottom Layer w0.5: R33.1 32.63,14.02 30.98,12.37 v1(15.23,12.37)
PWMV_H_5V: length 14.7
  Top Layer w0.35: U1.25 v1(27.49,32.42)
  Bottom Layer w0.35: v1(31.75,23.84) 31.75,28.61 30.98,29.39 28.94,29.39 27.93,30.4 27.93,31.98 v1(27.49,32.42)
  Bottom Layer w0.5: v1(31.75,23.84) 31.66,23.76 Q2.3
PWMW_H: length 32.1
  Top Layer w0.5: U17.9 8.77,11.35 v1(11.54,11.35)
  Bottom Layer w0.5: v1(11.54,11.35) 33.77,11.35 36.03,13.61 R6.1
PWMW_H_5V: length 17
  Top Layer w0.35: U1.23 v1(28.69,31.12)
  Bottom Layer w0.35: v1(28.69,31.12) 28.73,31.16 33.13,31.16 35.18,29.12 R35.1 35.18,22.01 Q1.3
$1N503: length 6.9
  Top Layer w0.5: U15.1 28.37,22.9 27.85,23.42 22.86,23.42 v1(22.72,23.56)
$1N1583: length 4.5
  Top Layer w0.35: U1.2 21.98,33.72 22.79,34.53 22.79,36.37
$1N1586: length 3.2
  Top Layer w0.35: U1.1 21.36,34.37 21.7,34.72 21.7,36.05 C8.2
$1N1604: length 2.7
  Top Layer w0.35: C9.1 19.47,33.07 U1.3
$1N1822: length 2.2
  Top Layer w0.35: R32.2 28.26,27.87 U1.18
$1N1825: length 8.4
  Top Layer w0.35: 28.27,26.57 27.62,27.22 U1.17 ; 28.27,26.57 U1.16 ; 28.27,26.57 R32.1 27.81,25.92 U1.15 26.34,25.77 C16.2
$1N2334: length 2
  Bottom Layer w0.5: Q1.1 36.12,18.16 R6.2
$1N2420: length 1.8
  Bottom Layer w0.5: R33.2 32.61,18.21 Q2.1
$1N2505: length 1.7
  Bottom Layer w0.5: R34.2 29.13,18.26 Q3.1
$1N2864: length 2.1
  Top Layer w0.5: R38.2 17.71,9.41 Q4.1

## Copper pours and planes (outline as drawn; the poured copper is in the pictures)
+12V on POWER: 0.26,40.23 42.29,40.23 42.29,0.26 0.26,0.26
GND on GND: 0.26,40.23 42.29,40.23 42.29,0.26 0.26,0.26

Small or netless copper shapes (teardrops, artwork), in the pictures only: 95 on Top Layer, 68 on Bottom Layer, 4 on POWER, 4 on GND
